# EAGLE design GPS-SIM5320-3G-MICROMOD-Male (EAGLE 9.5.1)
COMPANY: ADAFRUIT INDUSTRIES; DRAWN: KTOWN; REV: A
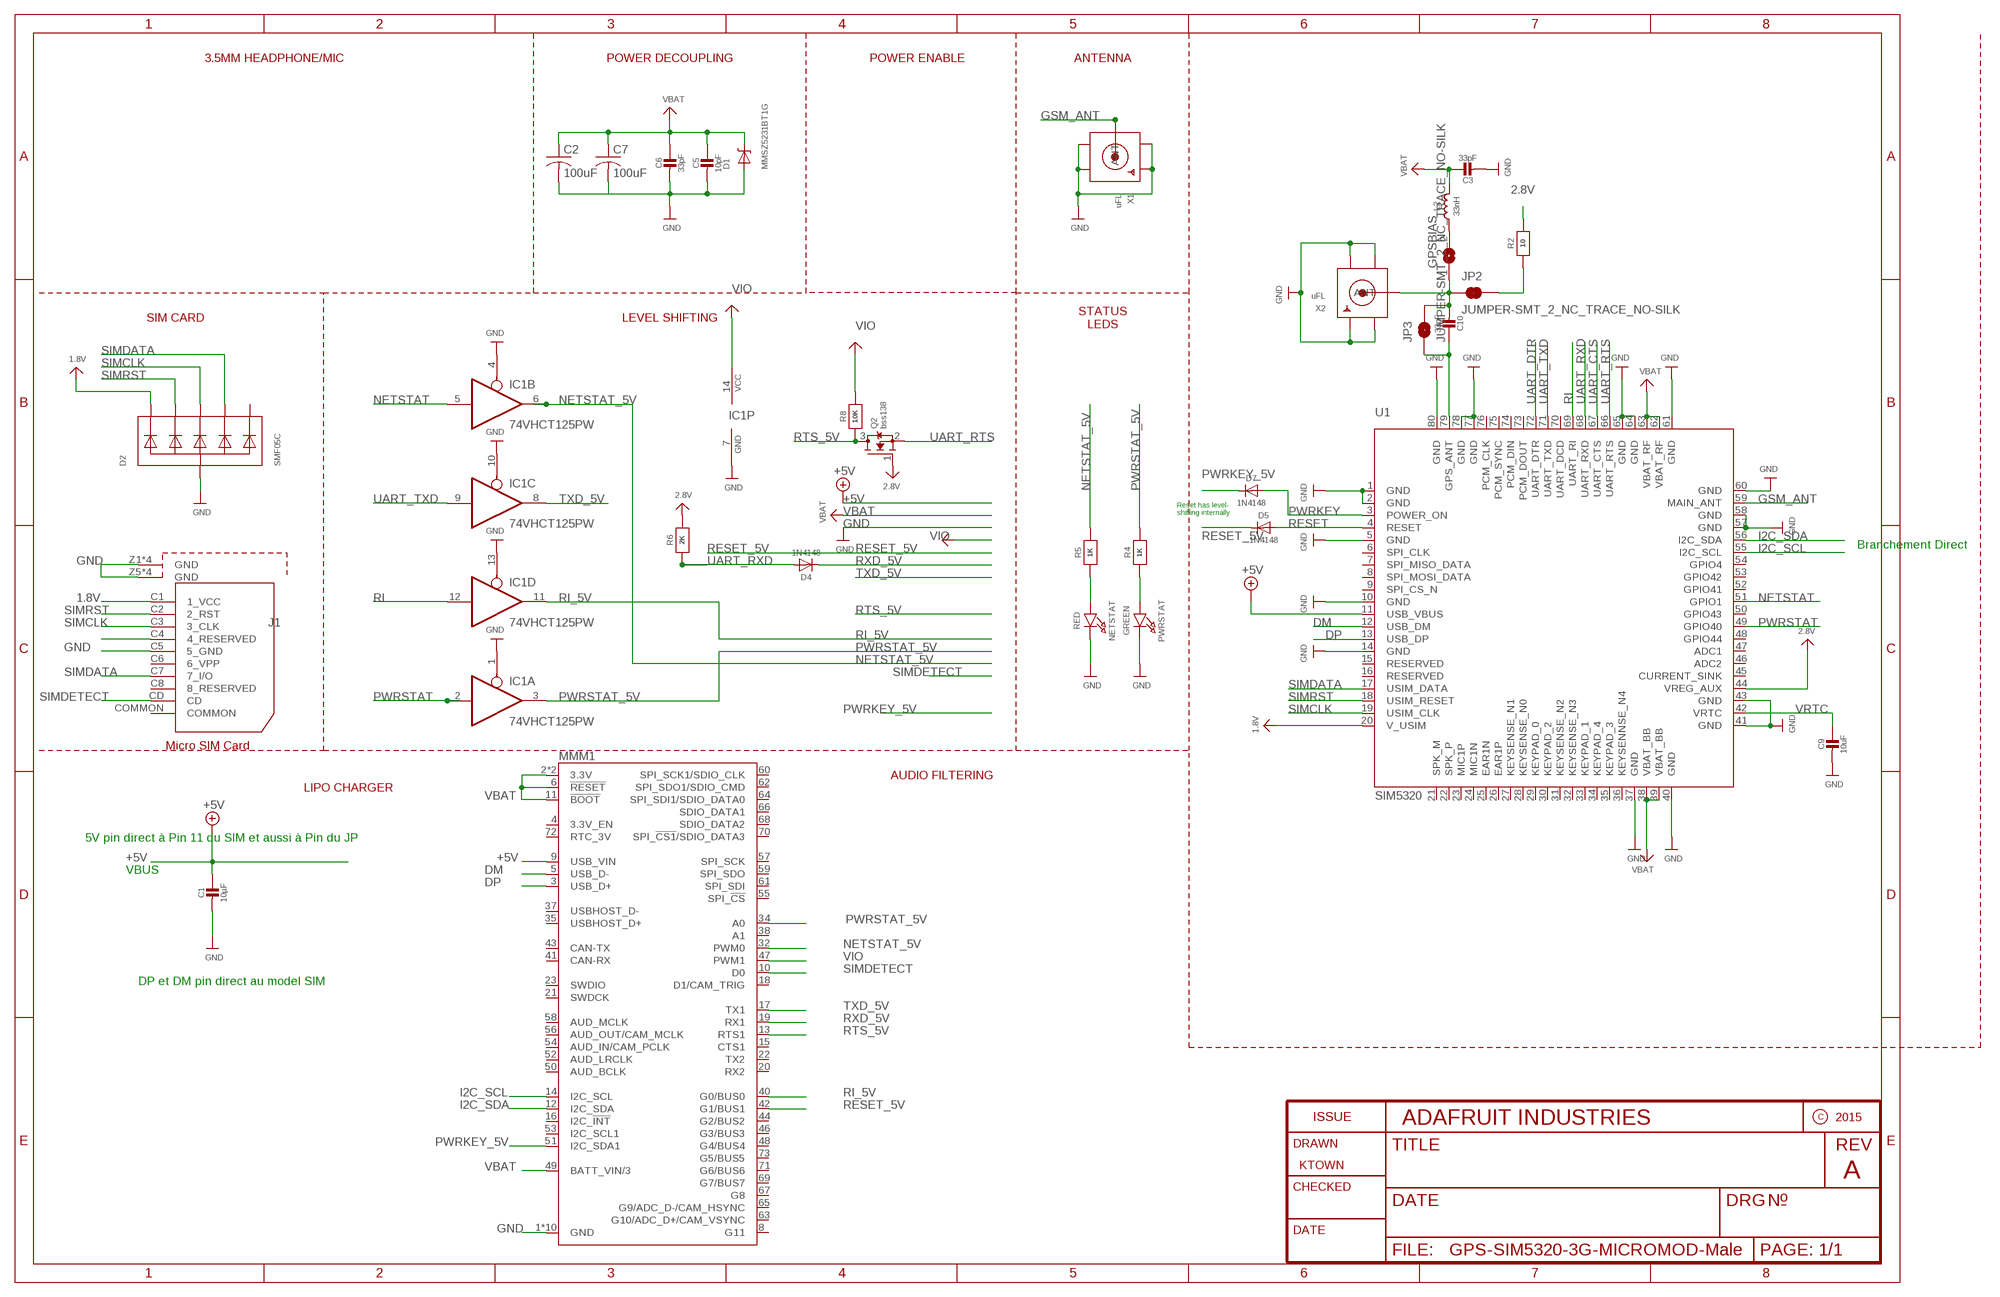
[diagram p0: schematic, sheet 1]

## Parts
C1  10µF  CAP_CERAMIC0805-NOOUTLINE  [0805-NO]
C2  100uF  C-USC1210  [C1210]
C3  33pF  CAP_CERAMIC0805-NOOUTLINE  [0805-NO]
C5  10pF  CAP_CERAMIC0805-NOOUTLINE  [0805-NO]
C6  33pF  CAP_CERAMIC0805-NOOUTLINE  [0805-NO]
C7  100uF  C-USC1210  [C1210]
C9  10uF  CAP_CERAMIC0805-NOOUTLINE  [0805-NO]
C10  33pF  CAP_CERAMIC0805-NOOUTLINE  [0805-NO]
D1  MMSZ5231BT1G  DIODE-ZENERSOD123  [SOD-123]
D2  SMF05C  TVSARRAY_5LANE  [SOT363]
D4  1N4148  DIODESOD-323  [SOD-323]
D5  1N4148  DIODESOD-323  [SOD-323]
D7  1N4148  DIODESOD-323  [SOD-323]
GPSBIAS  SOLDERJUMPER  [SOLDERJUMPER_ARROW_NOPASTE]
IC1  74VHCT125PW  74ABT125PW  [TSSOP14]
J1  693021010811  [693021010811]
JP2  JUMPER-SMT_2_NC_TRACE_NO-SILK  [SMT-JUMPER_2_NC_TRACE_NO-SILK]
JP3  JUMPER-SMT_2_NC_TRACE_NO-SILK  [SMT-JUMPER_2_NC_TRACE_NO-SILK]
L2  33nH  INDUCTOR_0805MP  [_0805MP]
MMM1  MICROMOD_4222_MALE  [MICROMOD_4222_MALE]
NETSTAT  RED  LED0805_NOOUTLINE  [CHIPLED_0805_NOOUTLINE]
PWRSTAT  GREEN  LED0805_NOOUTLINE  [CHIPLED_0805_NOOUTLINE]
Q2  bss138  MOSFET-NWIDE  [SOT23-WIDE]
R2  10  RESISTOR0805_NOOUTLINE  [0805-NO]
R4  1K  RESISTOR0805_NOOUTLINE  [0805-NO]
R5  1K  RESISTOR0805_NOOUTLINE  [0805-NO]
R6  2K  RESISTOR0805_NOOUTLINE  [0805-NO]
R8  10K  RESISTOR0805_NOOUTLINE  [0805-NO]
U1  SIM5320  GSM_SIM5320_LITERAL  [SIM5320]
X1  uFL  SMACONNECTOR_EDGE_UFL  [SMA_EDGELAUNCH_UFL]
X2  uFL  SMACONNECTOR_EDGE_UFL  [SMA_EDGELAUNCH_UFL]

## Nets
1.8V: D2.1(C1) J1.C1(1_VCC) U1.20(V_USIM)
2.8V: Q2.1(G) R2.2 R6.2 U1.44(VREG_AUX)
+5V: C1.1 MMM1.9(USB_VIN) U1.11(USB_VBUS)
DM: MMM1.5(USB_D-) U1.12(USB_DM)
DP: MMM1.3(USB_D+) U1.13(USB_DP)
GND: C1.2 C2.2 C3.2 C5.2 C6.2 C7.2 C9.2 D1.A D2.2(A) IC1.1(A:OE) IC1.4(B:OE) IC1.7(P:GND) IC1.10(C:OE) IC1.13(D:OE) J1.C5(5_GND) J1.Z1(GND) J1.Z2(GND) J1.Z3(GND) J1.Z4(GND) J1.Z5(GND) J1.Z6(GND) J1.Z7(GND) J1.Z8(GND) MMM1.1(GND) MMM1.7(GND) MMM1.33(GND) MMM1.36(GND) MMM1.39(GND) MMM1.45(GND) MMM1.75(GND) MMM1.GND1(GND) MMM1.GND2(GND) MMM1.GND3(GND) NETSTAT.C PWRSTAT.C U1.1(GND) U1.2(GND) U1.5(GND) U1.10(GND) U1.14(GND) U1.37(GND) U1.40(GND) U1.41(GND) U1.43(GND) U1.57(GND) U1.58(GND) U1.60(GND) U1.61(GND) U1.64(GND) U1.65(GND) U1.77(GND) U1.78(GND) U1.80(GND) X1.GND@1(GND1) X1.GND@2(GND2) X1.GND@3(GND3) X1.GND@4(GND4) X2.GND@1(GND1) X2.GND@2(GND2) X2.GND@3(GND3) X2.GND@4(GND4)
GSM_ANT: U1.59(MAIN_ANT) X1.P(ANT)
I2C_SCL: MMM1.14(I2C_SCL) U1.55(I2C_SCL)
I2C_SDA: MMM1.12(I2C_SDA) U1.56(I2C_SDA)
N$1: C10.2 GPSBIAS.1 JP2.1 JP3.2 X2.P(ANT)
N$2: C10.1 JP3.1 U1.79(GPS_ANT)
N$3: JP2.2 R2.1
N$4: PWRSTAT.A R4.1
N$9: NETSTAT.A R5.1
N$10: J1.C4(4_RESERVED)
N$31: GPSBIAS.2 L2.1
NETSTAT: IC1.5(B:I) U1.51(GPIO1)
NETSTAT_5V: IC1.6(B:O) MMM1.32(PWM0) R5.2
PWRKEY: D7.A U1.3(POWER_ON)
PWRKEY_5V: D7.C MMM1.51(I2C_SDA1)
PWRSTAT: IC1.2(A:I) U1.49(GPIO40)
PWRSTAT_5V: IC1.3(A:O) MMM1.34(A0) R4.2
RESET: D5.A U1.4(RESET)
RESET_5V: D5.C MMM1.42(G1/BUS1)
RI: IC1.12(D:I) U1.69(UART_RI)
RI_5V: IC1.11(D:O) MMM1.40(G0/BUS0)
RTS_5V: MMM1.13(RTS1) Q2.3(D) R8.1
RXD_5V: D4.C MMM1.19(RX1)
SIMCLK: D2.4(C3) J1.C3(3_CLK) U1.19(USIM_CLK)
SIMDATA: D2.5(C4) J1.C7(7_I/O) U1.17(USIM_DATA)
SIMDETECT: J1.CD MMM1.10(D0)
SIMRST: D2.3(C2) J1.C2(2_RST) U1.18(USIM_RESET)
TXD_5V: IC1.8(C:O) MMM1.17(TX1)
UART_CTS: U1.67(UART_CTS)
UART_DTR: U1.72(UART_DTR)
UART_RTS: Q2.2(S) U1.66(UART_RTS)
UART_RXD: D4.A R6.1 U1.68(UART_RXD)
UART_TXD: IC1.9(C:I) U1.71(UART_TXD)
VBAT: C2.1 C3.1 C5.1 C6.1 C7.1 D1.C L2.2 MMM1.2(3.3V) MMM1.6(!RESET!) MMM1.11(!BOOT!) MMM1.49(BATT_VIN/3) MMM1.74(3.3V) U1.38(VBAT_BB) U1.39(VBAT_BB) U1.62(VBAT_RF) U1.63(VBAT_RF)
VIO: IC1.14(P:VCC) MMM1.47(PWM1) R8.2 ; supply symbol labelled 2.8V
VRTC: C9.1 U1.42(VRTC)
Unconnected: D2.6(C5) J1.C6(6_VPP) J1.C8(8_RESERVED) J1.COMMON MMM1.4(3.3V_EN) MMM1.8(G11) MMM1.15(CTS1) MMM1.16(I2C_!INT!) MMM1.18(D1/CAM_TRIG) MMM1.20(RX2) MMM1.21(SWDCK) MMM1.22(TX2) MMM1.23(SWDIO) MMM1.35(USBHOST_D+) MMM1.37(USBHOST_D-) MMM1.38(A1) MMM1.41(CAN-RX) MMM1.43(CAN-TX) MMM1.44(G2/BUS2) MMM1.46(G3/BUS3) MMM1.48(G4/BUS4) MMM1.50(AUD_BCLK) MMM1.52(AUD_LRCLK) MMM1.53(I2C_SCL1) MMM1.54(AUD_IN/CAM_PCLK) MMM1.55(SPI_!CS!) MMM1.56(AUD_OUT/CAM_MCLK) MMM1.57(SPI_SCK) MMM1.58(AUD_MCLK) MMM1.59(SPI_SDO) MMM1.60(SPI_SCK1/SDIO_CLK) MMM1.61(SPI_SDI) MMM1.62(SPI_SDO1/SDIO_CMD) MMM1.63(G10/ADC_D+/CAM_VSYNC) MMM1.64(SPI_SDI1/SDIO_DATA0) MMM1.65(G9/ADC_D-/CAM_HSYNC) MMM1.66(SDIO_DATA1) MMM1.67(G8) MMM1.68(SDIO_DATA2) MMM1.69(G7/BUS7) MMM1.70(SPI_!CS1!/SDIO_DATA3) MMM1.71(G6/BUS6) MMM1.72(RTC_3V) MMM1.73(G5/BUS5) U1.6(SPI_CLK) U1.7(SPI_MISO_DATA) U1.8(SPI_MOSI_DATA) U1.9(SPI_CS_N) U1.15(RESERVED) U1.16(RESERVED) U1.21(SPK_M) U1.22(SPK_P) U1.23(MIC1P) U1.24(MIC1N) U1.25(EAR1N) U1.26(EAR1P) U1.27(KEYSENSE_N1) U1.28(KEYSENSE_N0) U1.29(KEYPAD_0) U1.30(KEYPAD_2) U1.31(KEYSENSE_N2) U1.32(KEYSENSE_N3) U1.33(KEYPAD_1) U1.34(KEYPAD_4) U1.35(KEYPAD_3) U1.36(KEYSENNSE_N4) U1.45(CURRENT_SINK) U1.46(ADC2) U1.47(ADC1) U1.48(GPIO44) U1.50(GPIO43) U1.52(GPIO41) U1.53(GPIO42) U1.54(GPIO4) U1.70(UART_DCD) U1.73(PCM_DOUT) U1.74(PCM_DIN) U1.75(PCM_SYNC) U1.76(PCM_CLK)

## Notes on the sheet
- 3.5MM HEADPHONE/MIC | POWER DECOUPLING | POWER ENABLE | ANTENNA
- SIM CARD | LEVEL SHIFTING
- STATUS
  LEDS
- Reset has level-
  shifting internally
- Branchement Direct
- AUDIO FILTERING
- LIPO CHARGER
- 5V pin direct à Pin 11 du SIM et aussi à Pin du JP
- VBUS
- DP et DM pin direct au model SIM

## Library data of the parts
C1 C3 C5 C6 C9 C10 = microbuilder:CAP_CERAMIC: Ceramic Capacitors For new designs, use the packages preceded by an '_' character since they are more reliable: The following footprints should be used on most boards: _0402 - Standard footprint for regular board layouts _0603 - Standard footprint for regular board layouts _0805 - Standard footprint for regular board layouts _1206 - Standard footprint for regular board layouts For extremely tight-pitch boards where space is at a premium, the following 'micro-pitch' footprints can be used (smaller pads, no silkscreen outline, etc.): _0402MP - Micro-pitch footprint for very dense/compact boards _0603MP - Micro-pitch footprint for very dense/compact boards _0805MP - Micro-pitch footprint for very dense/compact boards _1206MP - Micro-pitch footprint for very dense/compact boards
C2 C7 = rcl:C-US: CAPACITOR, American symbol
D1 = microbuilder:DIODE-ZENER: Zener Diode SMA: 30V 1W Zener Diode, 1.2Vf - Digikey: SMAZ30-FDICT-ND
D2 = microbuilder:TVSARRAY_5LANE: Voltage Transient Suppressor Array SOT363 SMF05C - 100W 5V: Digikey - SMF05CT1GOSCT-ND
D4 D5 D7 = microbuilder:DIODE: Diode SMA Model Volts Amps Type Vf Ir Digikey # Notes SSA34-E3 40V 3A Schottky 480mV @ 3A 200uA @ 40V SSA34-E3/61TGITR-ND CDBA120-G 20V 1A Schottky 500mV @ 1A 500uA @ 20V 641-1014-6-ND REEL MBRA210 10V 2A Schottky 350mV @ 2A 700uA @ 10V MBRA210LT3 SOD-123 Model Volts Amps Type Vf Ir Order # Notes BAT54T1G 30V 200mA Schottky 800mV @ 200mA 2uA @ 25V BAT54T1GOSTR-ND B0530W 30V 500mA Schottky 430mV @ 500mA 130uA @ 30V B0530W-FDICT-ND REEL MBR120 20V 1A Schottky 340mV @ 1A MBR120VLSFT1GOSCT-ND SOD-323 Model Volts Amps Type Vf Ir Order # Notes PMEG2005EJ 20V 500mA Schottky 355mV @ 500mA 568-4110-1-ND ZLLS410 10V 570mA Schottky 380mV @ 570mA ZLLS410CT-ND 1N4148WS 75V 150mA Silicon/Simple 1V 1N4148WSFSCT-ND REEL SOD-523 Model Volts Amps Type Vf Ir Order # Notes BAT54XV2 30V 200mA Schottky 0.8V @ 100mA BAT54XV2CT-ND TB751S 30V 30mA Schottky RB751S-40TE61CT-ND SOT23-R/W (R = Solder Paste/Reflow Ovens, W = Hand-Soldering) Model Volts Amps Type Vf Ir Order # Notes BAT54FILM 40V 300mA Schottky 497-7162-1-ND POWERDI-5 Model Volts Amps Type Vf Ir Order # Notes PDS560 60V 5A Schottky 670mV @ 5A 150uA @ 60V PDS560DICT-ND
GPSBIAS = microbuilder:SOLDERJUMPER: SMD Solder JUMPER Solder the two pads together to create a connection, or remove the solder to break it. REFLOW - Use this footprint for solder paste and reflow ovens. WAVE - Use this footprint for hand-soldering (larger pads). CLOSED - Has a trace between the two pads to ensure it is closed by default. The trace needs to be cut to disable the jumper, and can be closed again by creating a solder bridge between the two pads.; BOM: EXCLUDE
IC1 = 74xx-us:74*125: Quad bus BUFFER, 3-state
J1 = Wurth_Elektronik_Electromechanic_Input-Output_Connectors_rev16b:693021010811: WR-CRD_Micro SIM_Push & Push_w Card Detection_SMT Micro SIM Push & Push Type SMT - with Card Detection - 1.25mm Height Code:Con_I-O_COM_CRD_SIM_Micro_693021010811_693021010811 <http://katalog.we-online.de/media/images/eican/Con_I-O_COM_CRD_SIM_Micro_693021010811_pf2.jpg> Details see: http://katalog.we-online.de/en/em/693_021_010_811/693_021_010_811?m Created 2014-12-22, aslant tao 2014 (C) Würth Elektronik
JP2 JP3 = SparkFun-Jumpers:JUMPER-SMT_2_NC_TRACE: Normally closed trace jumper This jumper has a trace between two pads so it's normally closed (NC). Use a razor knife to open the connection. For best results follow the IPC guidelines for cutting traces: Cutout at least 0.063 mm (0.005 in). Remove all loose material to clean up the cut area. Seal the cut with an approved epoxy. Reapply solder to reclose the connection.
L2 = microbuilder:INDUCTOR: Inductors 0603: 10nH Ceramic Inductor - microwire antenna/RF (Digikey: 712-1434-2-ND) 0805: 560nH Ceramic Inductor - RF (Digikey: 553-1047-1-ND) 270nH Ceramic Inductor - Q = 40@250MHz, +-5%, 1 Ohm DC Resistance (Digikey: 535-10506-2-ND) 1007 (2518 Metric) SMT: 10µH 10% 250mOhm 820mA 1007 Inductor (Digikey: 587-2189-1-ND) 22µH 10% 500mOhm 580mA 1007 Inductor (Digikey: 587-2190-1-ND) 47µH 10% 950mOhm 420mA 1007 Inductor (Digikey: 587-2191-1-ND) 47µH 5% 100mOhm 1A 1008 Inductor (Digikey: 732-1816-1-ND) 5.0x5.0mm (Taiyo Yuden NR5040 Series) 6.8µH 20% 2.3A 64mOhm Inductor (Digikey: 587-2374-2-ND) 5.0x5.0mm (TDK VLC5045 Series) 4.7µH 20% 3.3A 34mOhm Inductor (Digikey: 445-6526-1-ND) 6.8µH 20% 2.7A 46mOhm Inductor (Digikey: 445-6527-1-ND) 6.0x6.0mm (TDK VLC6045 Series) 4.7µH 20% 3.8A 27mOhm Inductor (Digikey: 445-6538-2-ND) 6.8µH 20% 3A 41mOhm Inductor (Digikey: 445-6540-1-ND) 6.2µH 30% 2.2A 45mOhm Inductor (Digikey: SRR5028-6R2YCT-ND) - Not TDK VLC6045 but footprint should match 6.0x6.0mm (TDK SLF6045 Series) 6.8uH 30% 2A 33mOhm Inductor (Digikey: 445-4572-1-ND, Mouser: 810-SLF645T6R8N2R0PF) 6.0x6.0mm (Sumida CDRH5D28 Series) 6.2uH 30% 1.8A 45mOhm Inductor (Digikey: 308-1542-1-ND) Taiyo Yuden NR3015T2R2M - 2.2uH 20% 1.5A (Digikey: 587-1648-2-ND, Mouser: 963-NR3015T2R2M) - Used with TI TPS62172 CoilCraft RFID Transponder Coil - MA5532-AE (For use with AS3935 Lightning Sensor) Vishay IHLP 1.0uH Molded Inductor - 24mOhm DCR, 5A, +/-20%, -55°C-125°C (Digikey: 541-1319-1-ND)
MMM1 = Micromod_4222_Male_NoDim:MICROMOD_4222_MALE
NETSTAT PWRSTAT = microbuilder:LED: LED 0603 - 0603 Surface Mount Package 2mA: Green LED - Low Power (3.9mcd, 2ma, 1.7Vf) - Digikey: 475-2709-2-ND Orange LED - Low Power (9.8mcd, 2ma, 1.8Vf) - Digikey: 475-1194-2-ND Red LED - Low Power (5mcd, 2ma, 1.8Vf) - Digikey: 475-1195-2-ND Yellow LED - Low Power (7mcd, 2ma, 1.8Vf) - Digikey: 475-1196-2-ND 5mA: Blue LED - Low Power (17mcd, 5ma, 2.9Vf) - Digikey: LNJ937W8CRACT-ND 0805 - 0805 Surface Mount Package 2mA: Red LED (8.8mcd, 2mA, 1.8Vf, Clear) - Low Power [Digikey: 475-2510-1-ND] Green LED (5mcd, 2mA, 1.8Vf, Clear) - Low Power [Digikey: 475-2730-1-ND] Yellow LED (11.3mcd, 2mA, 1.8Vf, Clear) - Low Power [Digikey: 475-2555-1-ND] 20mA: Red LED (104mcd, 20mA, Diffused) - LS R976 [Digikey: 475-1278-6-ND] Red LED (12mcd, 20mA, 2.0Vf, Clear) - APT2012EC [Digikey: 754-1128-1-ND] Green LED (15mcd, 20mA, 2.2Vf, Clear) - APT2012GC [Digikey: 754-1131-1-ND] Orange LED (160mcd, 20mA, 2.1Vf, Clear) - APT2012SECK [Digikey: 754-1130-1-ND] 1206 - 1206 Surface Mount Package Green LED (26mcd, 20mA, Diffused) - LG N971 [Digikey: 475-1407-6-ND] Red LED (15mcd, 20mA, Diffused) - LH N974 [Digikey: 475-1416-6-ND] Cree - Cree High-Power Surface Mount LEDs XPEBWT-L1-0000-00D50 - White 111lm 350mA 2.9Vf 6200K 110° XTEAWT-00-0000-00000LEE3 - White 114lm 350mA 2.85Vf 5000K 115° Everlight - Everlight 45-21 Series Surface Mount LEDs 45-21/QK2C-B2832AC2CB2/2T - Warm White 2000mcd 20mA 3.25Vf 3050K 120° 45-21/LK2C-B38452C4CB2/2T - Nuetral White 2000mcd 20mA 3.25Vf 4150K 120° 45-21/LK2C-B50634C6CB2/2T - Cold White 2200mcd 20mA 3.25Vf 5650K 120° PLCC2 Reverse Mount LS T77K-J1L2-1-0-2-R18-Z - Red 11.25mcd 2mA 1.8Vf 630nm 120° LO T77K-L1M2-24-Z - Orange 19.6mcd 2mA 1.8Vf 606nm 120° LY T77K-K2M1-26-Z - Yellow 15.7mcd 2mA 1.8Vf 587nm 120°
Q2 = microbuilder:MOSFET-N: N-Channel Mosfet LEGEND VDS: Voltage Drain-Source ID: Drain Current RDS(ON): Drain-Source On-State Resistance VGS(TH): Gate-Source Threshold Voltage CISS: Drain-Source Input Capacitance SOT-23 Name VDS ID RDS(ON) VGS(TH) CISS Order Number 2N7002E 60V 260mA 2.5 Ohm 2.5V @ 250uA 26.7pF @ 25V 2N7002ET1GOSTR-ND BSH103 30V 850mA 400 mOhm 400mV @ 1mA 83pF @ 24V BSH103,235-ND BSS138 60V 320mA 1.6 Ohm 1.5V @ 250uA 50pF @ 10V Mouser: 771-BSS138PW115 DMN2075U-7 20V 4.2A 38 mOhm 1V @ 250 uA 594.3pF @ 10V DMN2075U-7DICT-ND * BSS138 good choice for I2C level-shifting POWERPAK 1212-8 Name VDS ID RDS(ON) VGS(TH) CISS Order Number Si7308DN 60V 6A 58 mOhm 3V @ 250uA 665pF @ 15V SI7308DN-T1-E3CT-ND
R2 R4-R6 R8 = microbuilder:RESISTOR: Resistors For new designs, use the packages preceded by an '_' character since they are more reliable: The following footprints should be used on most boards: _0402 - Standard footprint for regular board layouts _0603 - Standard footprint for regular board layouts _0805 - Standard footprint for regular board layouts _1206 - Standard footprint for regular board layouts For extremely tight-pitch boards where space is at a premium, the following 'micro-pitch' footprints can be used (smaller pads, no silkscreen outline, etc.): _0402MP - Micro-pitch footprint for very dense/compact boards _0603MP - Micro-pitch footprint for very dense/compact boards _0805MP - Micro-pitch footprint for very dense/compact boards _1206MP - Micro-pitch footprint for very dense/compact boards
U1 = microbuilder:GSM_SIM5320_LITERAL
X1 X2 = microbuilder:SMACONNECTOR: SMA Connector 90° DIP SMA Connector, 50 Ohm (4UConnector: 07259); SPICEPREFIX: X

## Board
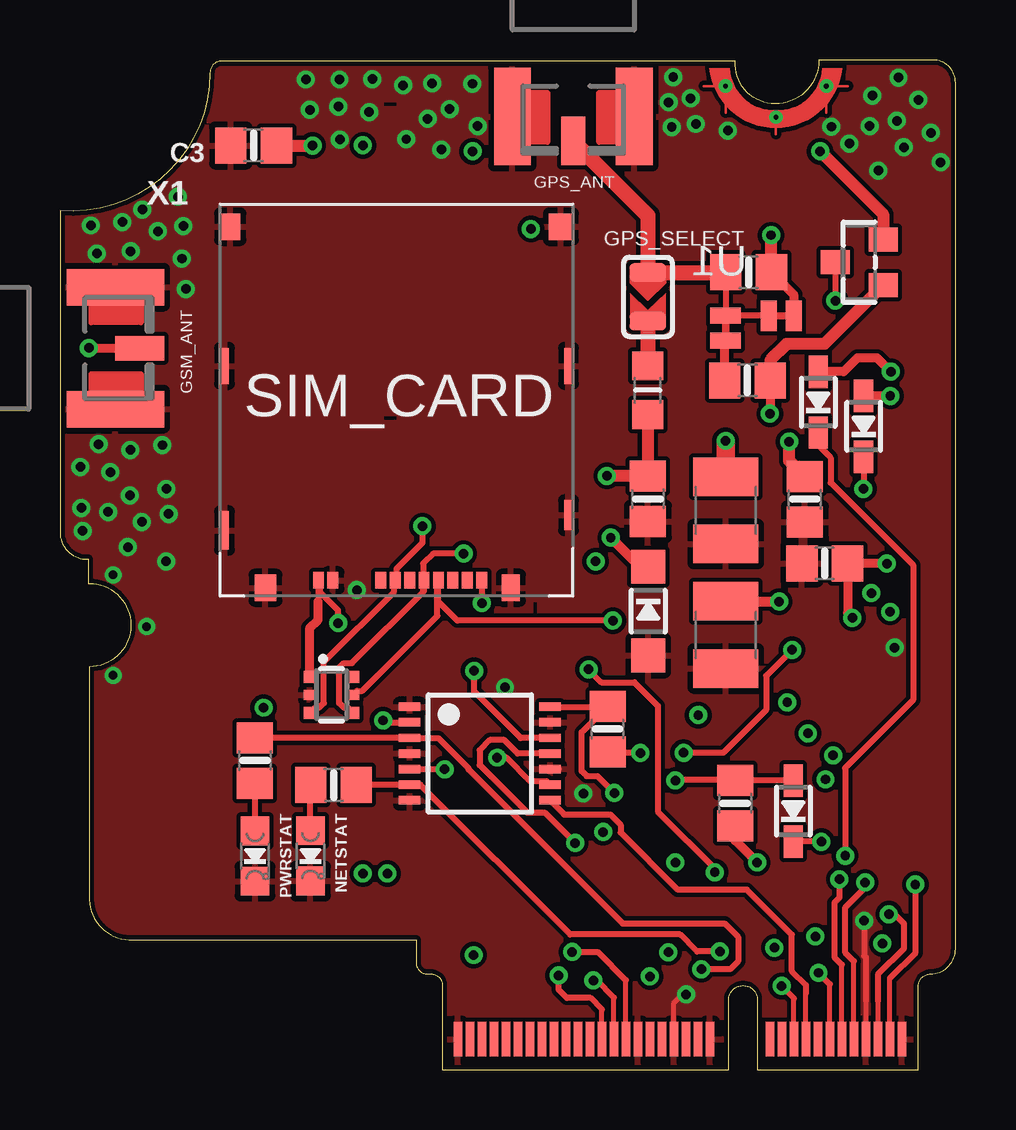
[diagram p1: board, top side]
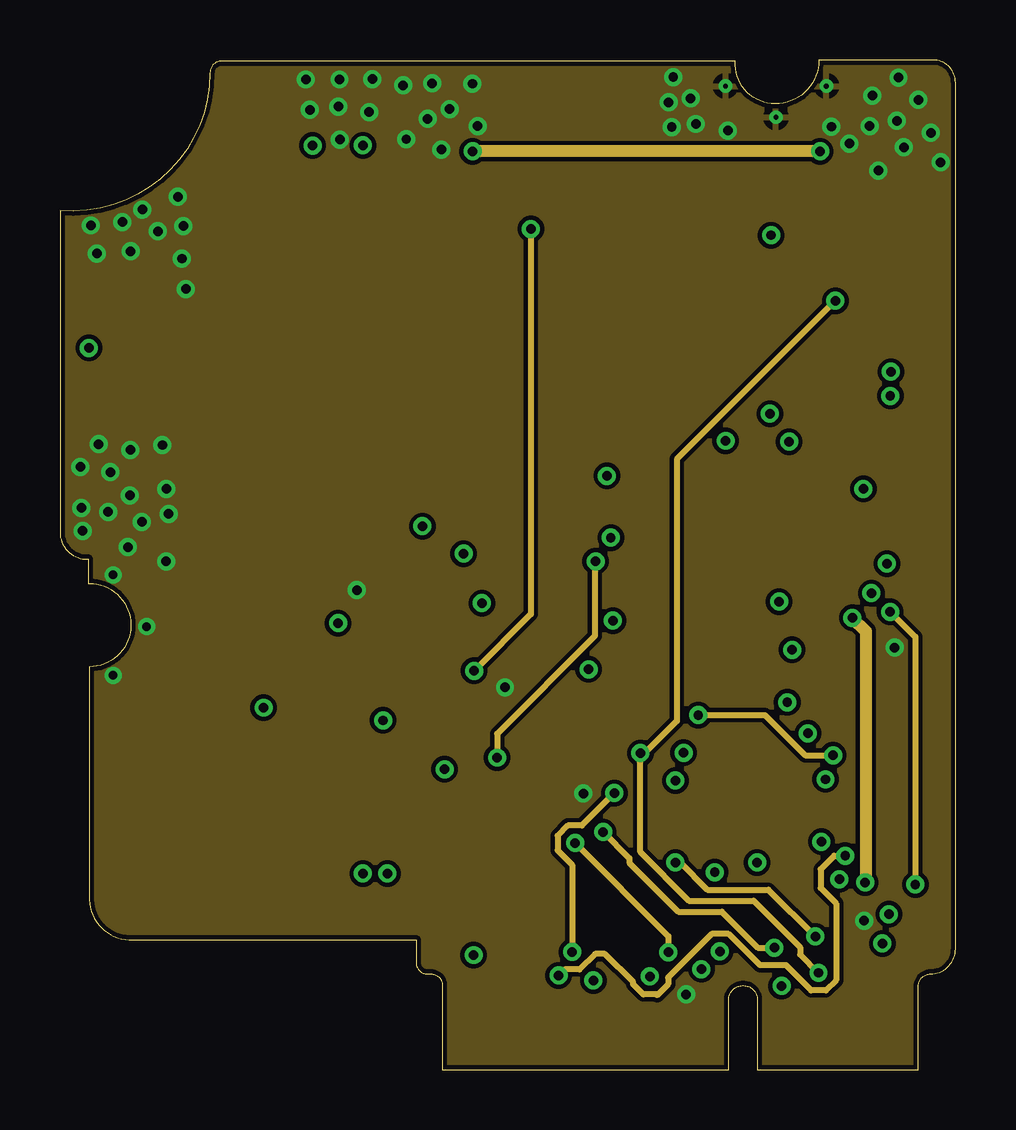
[diagram p2: board, inner layer GND]
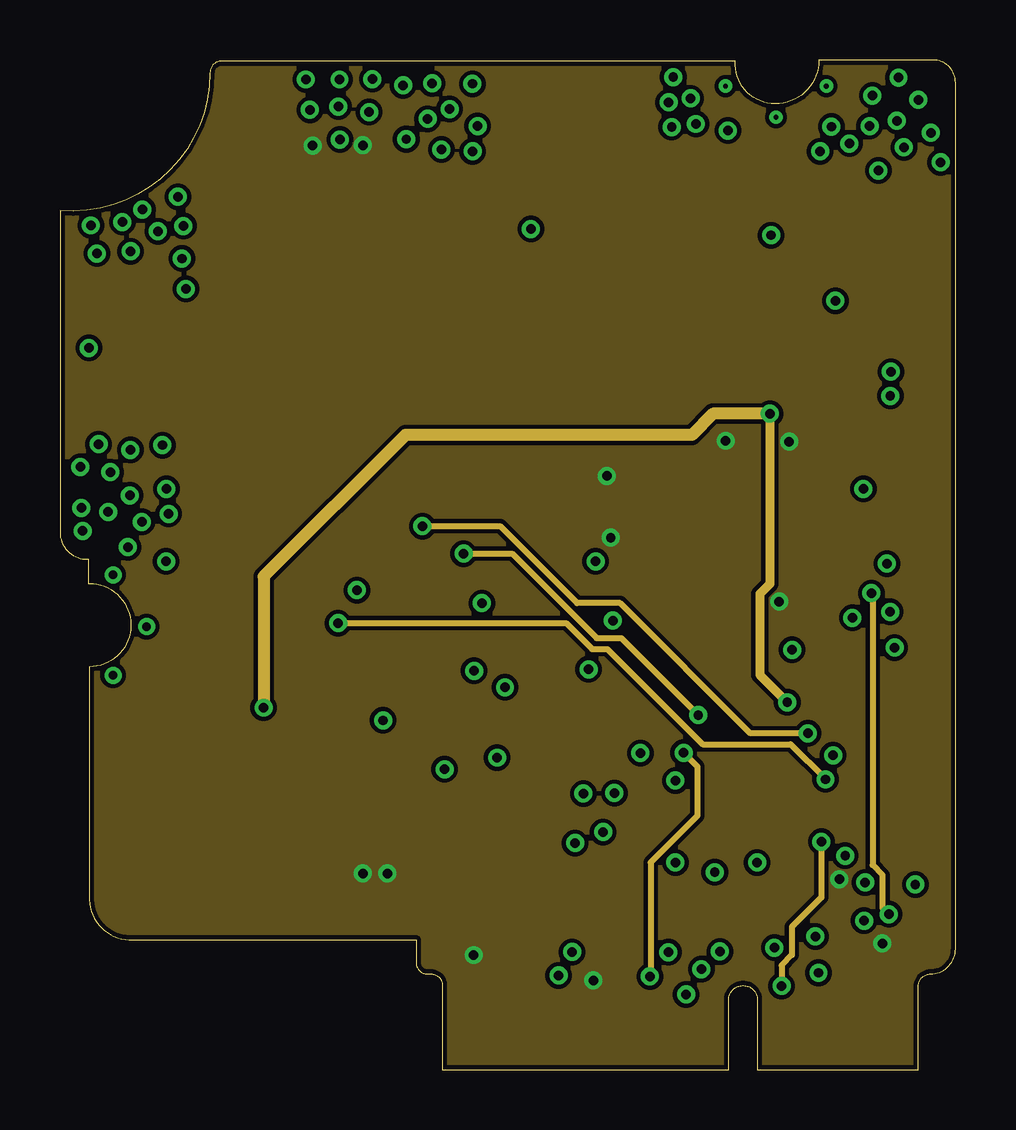
[diagram p3: board, inner layer VBAT]
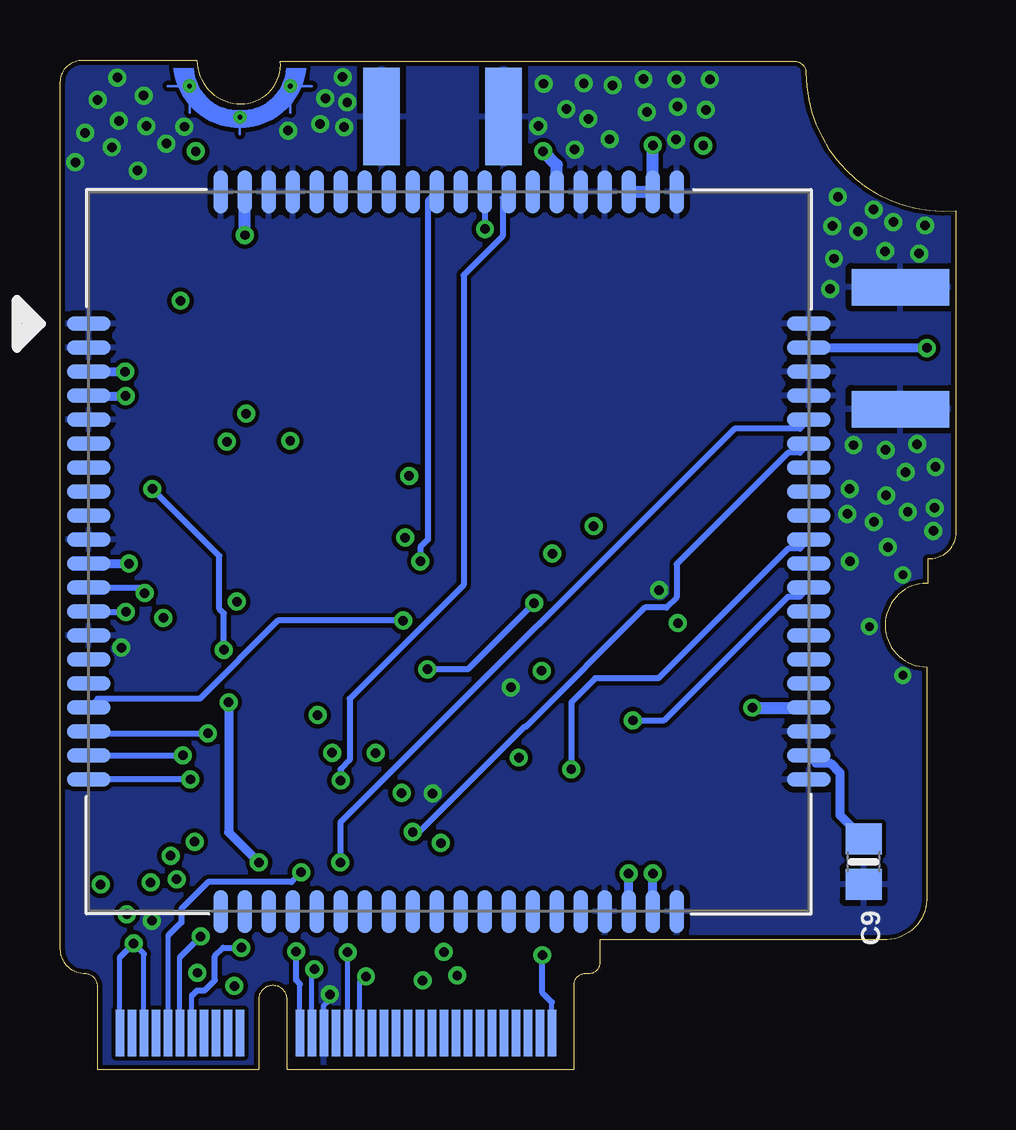
[diagram p4: board, bottom side, seen from below]

Size 37.31 x 42.09 mm. Coordinates in mm from the lower left corner, seen from the top.
Outline: 36.37,42.09 31.62,42.09 arc-90 29.79,40.26 arc-94 28.14,42.04 6.73,42.04 arc90 6.25,41.55 arc-95 0,35.81 0,22.4 arc93 1.17,21.28 1.17,20.27 1.22,20.27 arc-90 2.95,18.54 2.95,18.52 arc-90 1.22,16.79 1.22,7.24 arc90 2.87,5.41 14.83,5.41 14.83,4.47 arc90 15.32,3.99 15.47,3.99 arc-90 15.93,3.53 15.93,0 27.86,0 27.86,2.92 arc-90 28.45,3.5 28.47,3.5 arc-90 29.06,2.92 29.06,0 35.74,0 arc90 35.76,0.03 35.76,3.48 arc-90 36.27,3.99 arc90 37.31,5.03 37.31,41.15 arc90 36.37,42.09
Copper layers (1+2*15+16): Top 0.035mm / dielectric 0.2mm / GND 0.0175mm / dielectric 1.465mm / VBAT 0.0175mm / dielectric 0.2mm / Bottom 0.035mm
Design rules "SparkFun-2-layer-TIGHT *": minimum track width 7mil, minimum drill 12mil, track to track 7mil, track to pad 5mil, pad to pad 5mil, via to via 7mil, smd to smd 5mil, copper to edge 7mil, drill to drill 7mil, minimum pad ring 7mil, minimum via ring 7mil, stop-mask expansion 4mil, vias tented up to drill 25mil, thermal gap 10mil
tRestrict: area 13.5,40.2 to 14,40.3; area 13.5,27.1 to 14,27.2; area 19.7,19 to 19.9,19.5; area 21.6,48.9 to 21.8,49.5

### Footprints (pad centres in the part's own frame; a part is rotated, then mirrored left to right if it is on the bottom)
0805-NO = smd 1.3 x 1.5: 1 -0.95,0; 2 0.95,0
C1210 = smd 1.6 x 2.7: 1 -1.4,0; 2 1.4,0
SOD-123 = smd 1.4 x 1.4: A 1.85,0; C -1.85,0
SOT363 = smd 0.5 x 0.5: 1 -0.75,-0.9; 3 0.75,-0.9; 4 0.75,0.9; 6 -0.75,0.9 | smd 0.4 x 0.5: 2 0,-0.9; 5 0,0.9
SOD-323 = smd 1.35 x 0.8: A 1.27,0; C -1.27,0
SOLDERJUMPER_ARROW_NOPASTE = smd 0.762 x 1.524: 1 -1.016,0; 2 1.016,0
TSSOP14 = smd 0.35 x 0.9: 1 -1.95,-2.925; 2 -1.3,-2.925; 3 -0.65,-2.925; 4 0,-2.925; 5 0.65,-2.925; 6 1.3,-2.925; 7 1.95,-2.925; 8 1.95,2.925; 9 1.3,2.925; 10 0.65,2.925; 11 0,2.925; 12 -0.65,2.925; 13 -1.3,2.925; 14 -1.95,2.925
693021010811 = smd 0.45 x 0.68: C1 3.25,-0.66; C2 0.05,-0.66; C3 -1.15,-0.66; C4 -2.35,-0.66; C5 2.65,-0.66; C6 -0.55,-0.66; C7 -1.75,-0.66; C8 -2.95,-0.66; CD -3.55,-0.66; COMMON 0.65,-0.66 | smd 0.75 x 1.1: Z1 -4.77,-0.35 | smd 0.37 x 1.25: Z2 -7.165,-3.375 | smd 0.37 x 1.5: Z3 -7.165,-9.6; Z6 7.165,-9.6 | smd 1 x 1.1: Z4 -6.85,-15.4 | smd 0.85 x 1.1: Z5 6.925,-15.4 | smd 0.37 x 1.6: Z7 7.165,-2.74 | smd 0.9 x 1.1: Z8 5.46,-0.35
SMT-JUMPER_2_NC_TRACE_NO-SILK = smd 0.66 x 1.27: 1 -0.521,0; 2 0.521,0
_0805MP = smd 1.2 x 1.3: 1 -1.016,0; 2 1.016,0
MICROMOD_4222_MALE = smd 0.35 x 1.45: 1 9.25,1.275; 3 8.75,1.275; 5 8.25,1.275; 7 7.75,1.275; 9 7.25,1.275; 11 6.75,1.275; 13 6.25,1.275; 15 5.75,1.275; 17 5.25,1.275; 19 4.75,1.275; 21 4.25,1.275; 23 3.75,1.275; 33 1.25,1.275; 35 0.75,1.275; 37 0.25,1.275; 39 -0.25,1.275; 41 -0.75,1.275; 43 -1.25,1.275; 45 -1.75,1.275; 47 -2.25,1.275; 49 -2.75,1.275; 51 -3.25,1.275; 53 -3.75,1.275; 55 -4.25,1.275; 57 -4.75,1.275; 59 -5.25,1.275; 61 -5.75,1.275; 63 -6.25,1.275; 65 -6.75,1.275; 67 -7.25,1.275; 69 -7.75,1.275; 71 -8.25,1.275; 73 -8.75,1.275; 75 -9.25,1.275 | smd 0.35 x 1.95 bottom: 2 9,1.525; 4 8.5,1.525; 6 8,1.525; 8 7.5,1.525; 10 7,1.525; 12 6.5,1.525; 14 6,1.525; 16 5.5,1.525; 18 5,1.525; 20 4.5,1.525; 22 4,1.525; 32 1.5,1.525; 34 1,1.525; 36 0.5,1.525; 38 0,1.525; 40 -0.5,1.525; 42 -1,1.525; 44 -1.5,1.525; 46 -2,1.525; 48 -2.5,1.525; 50 -3,1.525; 52 -3.5,1.525; 54 -4,1.525; 56 -4.5,1.525; 58 -5,1.525; 60 -5.5,1.525; 62 -6,1.525; 64 -6.5,1.525; 66 -7,1.525; 68 -7.5,1.525; 70 -8,1.525; 72 -8.5,1.525; 74 -9,1.525 | drill 0.2: GND1 1.9,41; GND2 4,39.7; GND3 6.1,41
CHIPLED_0805_NOOUTLINE = smd 1.2 x 1.2: A 0,-1.05; C 0,1.05
SOT23-WIDE = smd 1 x 1.2: 1 -0.95,-1; 2 0.95,-1; 3 0,1
SIM5320 = smd 1.8 x 0.6: 1 -15,9.5; 2 -15,8.5; 3 -15,7.5; 4 -15,6.5; 5 -15,5.5; 6 -15,4.5; 7 -15,3.5; 8 -15,2.5; 9 -15,1.5; 10 -15,0.5; 11 -15,-0.5; 12 -15,-1.5; 13 -15,-2.5; 14 -15,-3.5; 15 -15,-4.5; 16 -15,-5.5; 17 -15,-6.5; 18 -15,-7.5; 19 -15,-8.5; 20 -15,-9.5; 41 15,-9.5; 42 15,-8.5; 43 15,-7.5; 44 15,-6.5; 45 15,-5.5; 46 15,-4.5; 47 15,-3.5; 48 15,-2.5; 49 15,-1.5; 50 15,-0.5; 51 15,0.5; 52 15,1.5; 53 15,2.5; 54 15,3.5; 55 15,4.5; 56 15,5.5; 57 15,6.5; 58 15,7.5; 59 15,8.5; 60 15,9.5 | smd 0.6 x 1.8: 21 -9.5,-15; 22 -8.5,-15; 23 -7.5,-15; 24 -6.5,-15; 25 -5.5,-15; 26 -4.5,-15; 27 -3.5,-15; 28 -2.5,-15; 29 -1.5,-15; 30 -0.5,-15; 31 0.5,-15; 32 1.5,-15; 33 2.5,-15; 34 3.5,-15; 35 4.5,-15; 36 5.5,-15; 37 6.5,-15; 38 7.5,-15; 39 8.5,-15; 40 9.5,-15; 61 9.5,15; 62 8.5,15; 63 7.5,15; 64 6.5,15; 65 5.5,15; 66 4.5,15; 67 3.5,15; 68 2.5,15; 69 1.5,15; 70 0.5,15; 71 -0.5,15; 72 -1.5,15; 73 -2.5,15; 74 -3.5,15; 75 -4.5,15; 76 -5.5,15; 77 -6.5,15; 78 -7.5,15; 79 -8.5,15; 80 -9.5,15
SMA_EDGELAUNCH_UFL = smd 4.064 x 1.524: GND@1 2.032,-2.54; GND@2 2.032,2.54 | smd 4.064 x 1.524 bottom: GND@3 2.032,2.54; GND@4 2.032,-2.54 | smd 2.032 x 1.016: P 3.048,0

### Placement (x,y rotation side)
C1  31.86,21.11 180 top
C2  27.74,18.12 270 top
C3  8.07,38.52 180 top
C5  31.03,23.78 270 top
C6  24.5,23.79 270 top
C7  27.74,23.32 270 top
C9  3.85,8.67 270 bottom
C10  28.69,33.24 180 top
D1  24.51,19.11 270 top
D2  11.31,15.62 270 top
D4  30.56,10.78 90 top
D5  33.48,26.82 90 top
D7  31.6,27.83 90 top
GPSBIAS  24.5,32.21 270 top
IC1  17.49,13.18 270 top
J1  14.02,19.74 180 top
JP2  27.74,30.91 270 top
JP3  30.05,31.42 180 top
L2  24.49,28.32 270 top
MMM1  25.83,0 0 top
NETSTAT  10.43,8.91 180 top
PWRSTAT  8.13,8.91 180 top
Q2  33.3,33.66 90 top
R2  28.64,28.73 0 top
R4  8.12,12.88 90 top
R5  11.4,11.87 0 top
R6  28.13,11.1 270 top
R8  22.81,14.19 90 top
U1  21.13,21.59 0 bottom
X1  0.28,30.07 0 top
X2  21.39,41.76 270 top

### Tracks (layer width: path | path; a pad name or v marks a point on that pad's centre or on a via)
1.8V  (via drill 0.39)
  Top 0.254: v11.59,18.61 11.59,19.15 10.82,19.92 10.82,20.35 J1.C1 10.75,20.4 10.75,19.49
  Top 0.381: 10.75,19.49 10.75,18.75 10.41,18.42 D2.1
  VBAT 0.254: v11.59,18.61 21.09,18.61 22.17,17.53 22.81,17.53 26.78,13.56 30.44,13.56 v31.9,12.11 v31.9,12.1
  Bottom 0.254: v31.9,12.1 U1.20
2.8V  (via drill 0.39)
  Top 0.381: v29.04,8.64 28.13,9.55 R6.2 | R2.2 29.59,27.36 v29.58,27.34
  Top 0.508: Q2.1 31.85,30.25 30.28,30.25 29.59,29.57 R2.2
  VBAT 0.381: v30.3,15.32 29.17,16.45 29.17,19.84 29.58,20.25 v29.58,27.34
  VBAT 0.508: v29.58,27.34 27.2,27.34 26.32,26.46 14.4,26.46 8.48,20.55 v8.48,15.09
  Bottom 0.381: v30.3,15.32 30.3,9.89 v29.04,8.64
  Bottom 0.508: v8.48,15.09 U1.44
+5V  (via drill 0.39)
  Top 0.203: MMM1.9 33.08,4.52
  Top 0.254: v33.55,7.8 33.55,7.59 32.73,6.77 32.73,4.88 33.08,4.52
  Top 0.381: v34.45,21.09 32.83,21.09 C1.1 32.81,19.04 v33.02,18.83
  GND 0.508: v33.02,18.83 33.57,18.28 33.57,7.83 v33.55,7.8
  Bottom 0.381: U1.11 v34.45,21.09
DM  (via drill 0.39)
  Top 0.203: 34.08,2.86 MMM1.5
  Top 0.254: v34.54,6.48 34.77,6.48 35.18,6.08 35.18,5.06 34.08,3.96 34.08,2.86
  VBAT 0.254: v33.81,19.86 33.86,19.81 33.86,8.53 34.28,8.1 34.28,6.74 v34.54,6.48
  Bottom 0.254: U1.12 34.03,20.09 v33.81,19.86
DP  (via drill 0.39)
  Top 0.203: MMM1.3 34.58,3.81
  Top 0.254: 34.58,3.81 35.65,4.88 35.65,7.71 v35.64,7.72
  GND 0.254: v34.59,19.09 35.64,18.04 v35.64,7.72
  Bottom 0.254: U1.13 v34.59,19.09
GND  (via drill 0.35, 0.39)
  Top 0.203: MMM1.39 25.58,2.78 25.94,3.14 26.06,3.14 | 33.58,2.88 MMM1.7
  Top 0.254: 26.06,3.14 v26.09,3.14 | IC1.10 20.79,12.53 | v33.5,6.21 33.5,4.75 33.58,4.67 33.58,2.88
  Bottom 0.203: MMM1.36 26.33,2.67 26.09,2.92 v26.09,3.14
  other vias: 12.37,19.99 2.83,21.78 1.61,26.07 2.91,23.94 4.27,26.04 0.89,23.42 2.1,24.9 4.42,21.18 0.85,25.12 1.28,35.19 1.54,34.02 2.6,35.33 2.95,34.11 34.77,17.59 15.51,41.11 15.32,39.64 13.02,41.29 15.89,38.35 17.4,39.33 25.36,40.32 32.14,39.31 33.73,39.33 33.85,40.6 35.17,38.44 17.18,41.1 16.23,40.04 12.88,39.92 10.25,41.27 10.41,40.01 14.43,38.79 14.3,41.03 11.65,41.27 11.6,40.14 11.66,38.77 25.55,41.38 26.28,40.49 26.49,39.42 25.49,39.29 27.83,39.14 34.94,41.35 35.76,40.42 32.89,38.61 34.1,37.48 36.69,37.82 34.87,39.55 36.28,39.05 3.43,35.85 4.91,36.39 4.08,34.95 5.08,33.81 5.14,35.17 2.93,25.83 2.01,23.25 0.94,22.45 4.43,24.21 4.52,23.16 3.42,22.83 18.54,15.94 21.81,11.51 5.25,32.54 2.21,16.43 2.21,20.62 3.61,18.47
  pour Top: 0.05,42.47 0.05,-0.2 37.77,-0.2 37.77,42.47
  pour Bottom: -0.46,42.47 -0.46,-0.33 37.9,-0.33 37.9,42.47
  pour GND: -0.33,42.47 -0.33,-0.48 37.93,-0.48 37.81,42.47
GSM_ANT  (via drill 0.39)
  Top 0.381: v1.21,30.09 3.31,30.09 X1.P
  Bottom 0.381: U1.59 v1.21,30.09
I2C_SCL  (via drill 0.39)
  GND 0.254: v22.63,9.91 23.72,8.81 23.72,8.62 25.76,6.59 27.58,6.59 29.08,5.08 v29.77,5.08
  Bottom 0.203: MMM1.14 31.83,3.09 31.83,3.1
  Bottom 0.254: U1.55 6.5,25.72 6.99,25.72 11.64,21.07 11.64,19.69 12.07,19.26 12.96,19.26 17.91,14.31 17.96,14.31 22.36,9.91 v22.63,9.91 | 31.83,3.1 31.62,3.31 31.3,3.31 30.87,3.73 30.87,4.74 30.53,5.08 v29.77,5.08
I2C_SDA  (via drill 0.39)
  GND 0.254: v31.47,5.55 29.52,7.5 26.98,7.5 25.84,8.64 v25.65,8.64
  Bottom 0.203: MMM1.12 32.33,4.68 32.33,4.69
  Bottom 0.254: U1.56 6.5,26.72 9.22,26.72 25.65,10.3 v25.65,8.64 | 32.33,4.69 v31.47,5.55
N$1
  Top 0.254: C10.2 JP2.1 | JP2.1 | JP3.2 27.76,31.42 JP2.1
  Top 0.635: X2.P 24.5,35.6 GPSBIAS.1 C10.2
N$2  (via drill 0.39)
  Top 0.381: C10.1 30.57,32.31 JP3.1
  Top 0.508: C10.1 29.64,34.77 v29.63,34.78
  Bottom 0.508: v29.63,34.78 U1.79
N$3
  Top 0.381: R2.1 27.69,30.31 27.74,30.35 JP2.2
N$4
  Top 0.254: R4.1 PWRSTAT.A
N$9
  Top 0.254: NETSTAT.A 10.43,11.85 R5.1
N$31
  Top 0.635: GPSBIAS.2 24.5,29.35 L2.1
NETSTAT  (via drill 0.39)
  Top 0.254: v16.03,12.52 IC1.5
  Bottom 0.254: U1.51 6.5,21.72 6.99,21.72 12.4,16.31 15.04,16.31 16.03,15.32 v16.03,12.52
NETSTAT_5V  (via drill 0.39)
  Top 0.254: v27.5,4.93 26.54,4.93 25.83,5.63 21.26,5.63 15.01,11.88 IC1.6 14.56,11.87 R5.2
  Bottom 0.203: MMM1.32 27.33,3.57
  Bottom 0.254: 27.33,3.57 27.5,3.73 v27.5,4.93
PWRKEY  (via drill 0.39)
  Top 0.381: v34.62,29.1 34.05,29.67 33.22,29.67 32.65,29.1 D7.A
  Bottom 0.381: U1.3 v34.62,29.09 v34.62,29.1
PWRKEY_5V  (via drill 0.39)
  Top 0.203: MMM1.51 22.58,2.51
  Top 0.254: D7.C 31.6,26.03 32.11,25.51 32.11,24.47 35.55,21.04 35.55,15.41 32.71,12.57 v32.71,8.92 v32.72,8.92 | 22.58,2.51 22.1,2.99 21.12,2.99 20.78,3.33 v20.78,3.92
  GND 0.254: v20.78,3.92 21.02,4.17 21.64,4.17 22.29,4.83 22.71,4.83 23.87,3.66 23.87,3.56 24.3,3.13 24.86,3.13 24.88,3.1 25.34,3.56 25.34,3.84 27.15,5.66 27.86,5.66 29.17,4.35 30.26,4.35 31.3,3.31 31.91,3.31 32.33,3.73 32.33,6.93 31.69,7.57 31.69,8.35 32.25,8.92 v32.72,8.92
PWRSTAT  (via drill 0.39)
  Top 0.254: IC1.2 14.54,14.45 13.46,14.45 v13.46,14.56
  Bottom 0.254: U1.49 6.5,19.72 6.99,19.72 12.15,14.56 v13.46,14.56
PWRSTAT_5V  (via drill 0.39)
  Top 0.254: R4.2 IC1.3 15.76,13.83 17.02,12.56 17.02,12.51 23.45,6.09 27.7,6.09 28.25,5.53 28.25,4.51 27.92,4.18 v26.73,4.18 v26.73,4.19
  Bottom 0.203: MMM1.34 26.83,4.09
  Bottom 0.254: 26.83,4.09 v26.73,4.19
RESET  (via drill 0.39)
  Top 0.381: D5.A 33.49,28.08 v34.59,28.08
  Bottom 0.381: U1.4 36.12,28.08 v34.59,28.08
RESET_5V  (via drill 0.39)
  Top 0.254: v30.51,17.5 29.42,16.41 29.42,14.99 27.64,13.21 v25.99,13.21 | D5.C v33.48,24.21
  VBAT 0.254: v25.99,13.21 26.56,12.63 26.56,10.59 24.61,8.63 24.61,3.91 v24.58,3.89
  Bottom 0.203: MMM1.42 24.83,3.63
  Bottom 0.254: v30.51,17.5 30.51,19.02 30.69,19.2 30.69,21.42 v33.48,24.21 | 24.83,3.63 v24.58,3.89
RI  (via drill 0.39)
  Top 0.254: IC1.12 19.19,13.83 17.26,15.76 v17.26,16.62
  GND 0.254: v19.62,35.04 19.62,18.99 v17.26,16.62
  Bottom 0.254: U1.69 v19.63,35.04 v19.62,35.04
RI_5V  (via drill 0.39)
  Top 0.254: IC1.11 19.07,13.18 18.51,13.73 17.91,13.73 17.48,13.31 17.48,12.7 19.46,10.72 20.19,10.72 v21.46,9.45
  GND 0.254: v21.46,9.45 25.35,5.56 v25.35,4.89
  Bottom 0.203: MMM1.40 25.33,4.88
  Bottom 0.254: 25.33,4.88 v25.35,4.89
RTS_5V  (via drill 0.39)
  Top 0.203: MMM1.13 32.08,3.56
  Top 0.254: v24.18,13.2 22.86,13.2 R8.1 | Q2.3 32.3,32.04 v32.31,32.05 | 32.08,3.56 v31.6,4.04
  GND 0.254: v32.31,32.05 25.7,25.45 25.7,14.53 24.37,13.2 v24.18,13.2 24.18,9.07 26.2,7.04 28.9,7.04 30.84,5.1 30.84,4.8 v31.6,4.04
RXD_5V  (via drill 0.39)
  Top 0.203: MMM1.19 30.58,2.97
  Top 0.254: v31.72,9.5 v31.71,9.51 D4.C | 30.58,2.97 v30.07,3.48
  VBAT 0.254: v31.72,9.5 31.72,7.18 30.5,5.95 30.5,4.78 30.07,4.35 v30.07,3.48
SIMCLK  (via drill 0.39)
  Top 0.254: D2.4 11.99,15.09 11.83,15.09 11.63,15.28 11.63,16.76 11.83,16.95 12.16,16.95 15.13,19.92 | v16.81,21.51 15.54,21.51 15.16,21.13 | J1.C3 15.16,21.13 | 15.13,20.36 J1.C3 | 15.13,19.92 15.13,20.36 | J1.C3 15.17,19.96 15.13,19.92 | 15.16,21.13 15.13,21.09 15.13,20.36
  GND 0.254: v26.59,14.78 29.37,14.78 31.05,13.1 v32.21,13.1
  VBAT 0.254: v16.81,21.51 18.83,21.51 22.36,17.99 23.39,17.99 v26.59,14.78
  Bottom 0.254: U1.19 32.22,13.09 v32.21,13.1
SIMDATA  (via drill 0.39)
  Top 0.254: v23.04,18.72 16.56,18.72 15.77,19.51 J1.C7 15.82,20.35 15.73,20.26 15.73,18.91 12.6,15.79 12.38,15.79 D2.5
  Bottom 0.254: U1.17 35.76,15.46 31.51,15.46 28.25,18.72 v23.04,18.72
SIMDETECT  (via drill 0.39)
  Top 0.254: v22.02,16.69 22.56,16.15 23.93,16.15 24.91,15.17 24.91,10.75 27.36,8.31 v27.28,8.23 | J1.CD v17.58,19.45
  Bottom 0.203: MMM1.10 32.82,1.54 32.82,5.59
  Bottom 0.254: v27.28,8.23 27.69,7.82 31.16,7.82 32.27,6.71 32.27,6.13 32.82,5.59 | v17.58,19.45 20.34,16.69 v22.02,16.69
SIMRST  (via drill 0.39)
  Top 0.254: D2.3 10.63,15.09 10.8,15.09 10.99,15.28 10.99,16.99 13.93,19.92 13.93,20.35 J1.C2 14.02,20.44 14.02,20.87 15.1,21.96 v15.1,22.66
  VBAT 0.254: v31.17,14.02 28.77,14.02 23.34,19.45 21.55,19.45 18.34,22.66 v15.1,22.66
  Bottom 0.254: U1.18 36.06,14.02 v31.17,14.02
TXD_5V
  Top 0.203: MMM1.17 31.08,3.19
  Top 0.254: IC1.8 21.01,10.64 22.93,10.64 23.36,10.21 23.36,9.89 25.75,7.5 28.62,7.5 30.5,5.62 30.5,4.11 31.09,3.52 31.09,3.2 31.08,3.19
UART_RTS  (via drill 0.39)
  Top 0.508: v31.67,38.28 34.3,35.65 Q2.2
  GND 0.508: v31.67,38.28 v17.2,38.28
  Bottom 0.508: U1.66 16.63,37.71 v17.2,38.28
UART_RXD  (via drill 0.39)
  Top 0.254: D4.A R6.1 28.11,12.08 25.62,12.08 v25.64,12.05
  Bottom 0.254: v25.64,12.05 25.64,12.52 25.26,12.91 25.26,15.45 20.51,20.2 20.51,33.11 18.89,34.74 18.89,36.33 U1.68
UART_TXD  (via drill 0.39)
  Top 0.254: IC1.9 20.27,12.02 19.58,12.02 18.6,13 v18.21,13
  GND 0.254: v18.21,13 18.21,14 22.29,18.08 22.29,21.16 v22.31,21.18
  Bottom 0.254: U1.71 22,36.22 22,22.09 22.31,21.78 v22.31,21.18
VBAT  (via drill 0.39)
  Top 0.203: MMM1.49 23.08,3 | MMM1.11 32.58,4.38
  Top 0.254: v22.22,3.72 22.36,3.72 23.08,3 | 32.58,4.38 32.27,4.69 32.27,6.96 32.47,7.16 v32.47,7.94
  Top 0.406: C2.1 29.95,19.52 v29.96,19.51 | v22.95,22.17 24.16,20.96 D1.C
  Top 0.508: v22.78,24.75 v22.79,24.74 C6.1 24.49,24.76 L2.2 | C3.1 v10.53,38.52 | C5.1 30.38,25.38 v30.38,26.17
  Top 0.762: C7.1 v27.74,26.21
  Bottom 0.203: MMM1.74 16.83,2.81 | MMM1.2 34.83,4.69 | MMM1.6 33.83,4.82
  Bottom 0.254: 34.83,4.69 v34.26,5.26 33.83,4.82 | v17.23,4.77 17.23,3.21 16.83,2.81
  Bottom 0.381: U1.38 13.63,8.17 v13.64,8.18 | U1.39 v12.62,8.18
  Bottom 0.508: U1.63 U1.62 v12.63,38.53 v12.62,38.53
  pour VBAT: -0.33,42.47 -0.33,-0.41 38.52,-0.41 38.4,42.47
VIO  (via drill 0.39)
  Top 0.203: MMM1.47 23.58,3.73
  Top 0.254: 23.58,3.73 22.41,4.9 v21.34,4.9 | v23.1,11.53 22.39,12.24 21.94,12.24 21.73,12.44 21.73,14.06 22.8,15.13 | IC1.14 22.8,15.13 | 22.8,15.13 R8.2
  GND 0.254: v21.34,4.9 21.34,8.54 20.73,9.15 20.73,9.75 21.16,10.18 21.75,10.18 v23.1,11.53
VRTC
  Bottom 0.381: U1.42 5.82,12.78 5.24,12.78 4.84,12.38 4.84,10.61 C9.1

### Text on the board
tPlace: GPS_ANT | GPS_SELECT | GSM_ANT | SIM_CARD